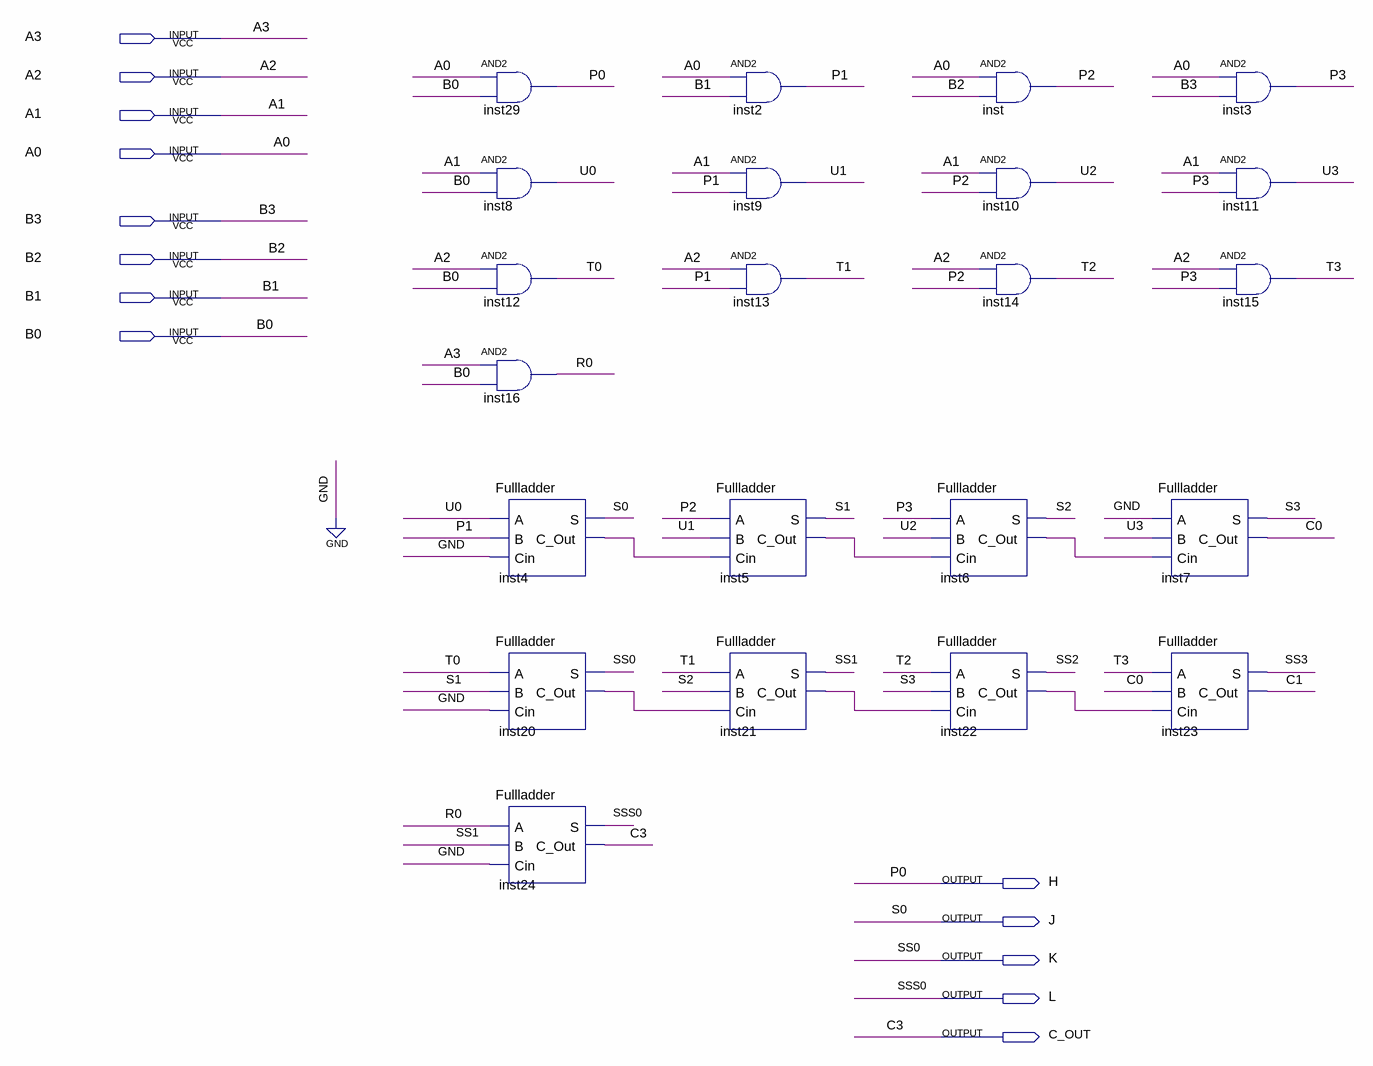
[diagram p0: schematic sheet]
// Quartus schematic Mult.bdf as structural Verilog: 22 symbols, 13 pins
module Mult (
  input  A3,
  input  A2,
  input  A1,
  input  A0,
  input  B3,
  input  B2,
  input  B1,
  input  B0,
  output H,
  output J,
  output K,
  output L,
  output C_OUT
);

  wire C0, C1, inst4_c_out, inst5_c_out, inst6_c_out, inst20_c_out, inst21_c_out, inst22_c_out, P1, P2, P3,
       R0, S1, S2, S3, SS1, SS2, SS3, T0, T1, T2, T3, U0, U1, U2, U3;

  and inst29 (H, A0, B0);
  and inst8 (U0, A1, B0);
  and inst12 (T0, A2, B0);
  and inst16 (R0, A3, B0);
  Fullladder inst4 (.A(U0), .B(P1), .Cin(1'b0), .S(J), .C_Out(inst4_c_out));
  Fullladder inst20 (.A(T0), .B(S1), .Cin(1'b0), .S(K), .C_Out(inst20_c_out));
  Fullladder inst24 (.A(R0), .B(SS1), .Cin(1'b0), .S(L), .C_Out(C_OUT));
  Fullladder inst5 (.A(P2), .B(U1), .Cin(inst4_c_out), .S(S1), .C_Out(inst5_c_out));
  Fullladder inst21 (.A(T1), .B(S2), .Cin(inst20_c_out), .S(SS1), .C_Out(inst21_c_out));
  and inst2 (P1, A0, B1);
  and inst9 (U1, A1, P1);
  and inst13 (T1, A2, P1);
  Fullladder inst6 (.A(P3), .B(U2), .Cin(inst5_c_out), .S(S2), .C_Out(inst6_c_out));
  Fullladder inst22 (.A(T2), .B(S3), .Cin(inst21_c_out), .S(SS2), .C_Out(inst22_c_out));
  and inst (P2, A0, B2);
  and inst10 (U2, A1, P2);
  and inst14 (T2, A2, P2);
  Fullladder inst7 (.A(1'b0), .B(U3), .Cin(inst6_c_out), .S(S3), .C_Out(C0));
  Fullladder inst23 (.A(T3), .B(C0), .Cin(inst22_c_out), .S(SS3), .C_Out(C1));
  and inst3 (P3, A0, B3);
  and inst11 (U3, A1, P3);
  and inst15 (T3, A2, P3);

  // Other names for the same wires on the sheet: C3 = C_OUT; P0 = H; S0 = J; SS0 = K; SSS0 = L
endmodule
